# Altium schematic sheet sdcard_ram.SchDoc
size Letter
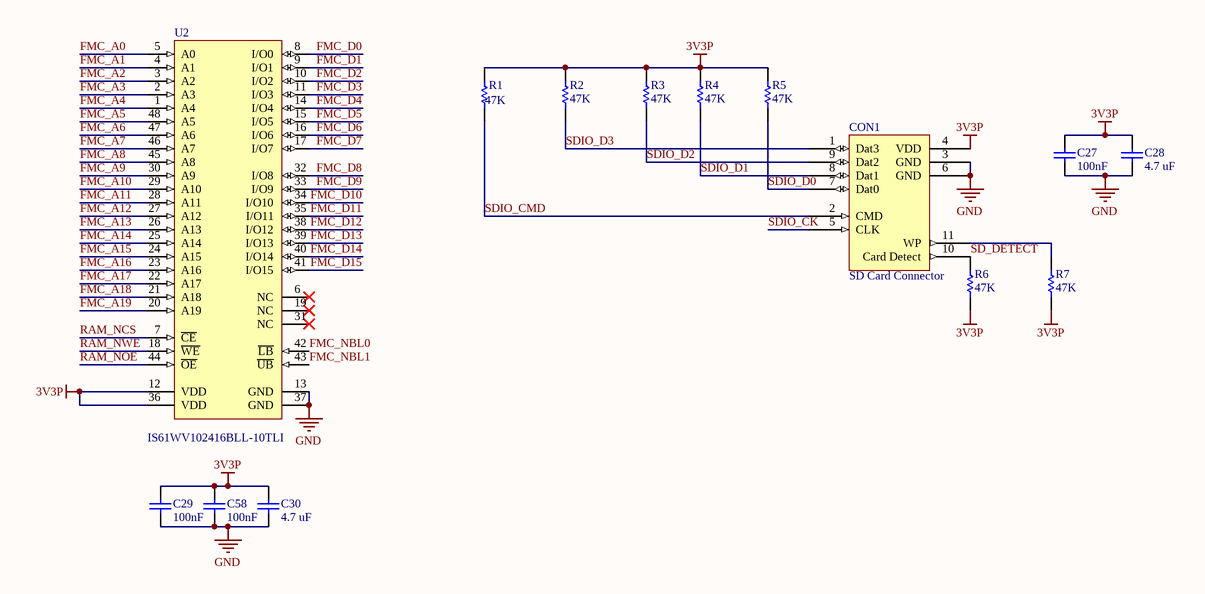
[diagram p0: sdcard_ram.SchDoc]

## Parts
C27  100nF  [C0805]
C28  4.7 uF  [C0805]
C29  100nF  [C0805]
C30  4.7 uF  [C0805]
C58  100nF  [C0805]
CON1  SD Card Connector  [SD_card_fp]
R1  47K  [6-0805_M]
R2  47K  [6-0805_M]
R3  47K  [6-0805_M]
R4  47K  [6-0805_M]
R5  47K  [6-0805_M]
R6  47K  [6-0805_M]
R7  47K  [6-0805_M]
U2  IS61WV102416BLL-10TLI  [ISSI-TSOP-1-48-12000X20000DE_N]

## Nets
3V3P: C27.2 C28.2 C29.2 C30.2 C58.2 CON1.4(VDD) R1.2 R2.2 R3.2 R4.2 R5.2 R6.1 R7.1 U2.12(VDD) U2.36(VDD)
GND: C27.1 C28.1 C29.1 C30.1 C58.1 CON1.3(GND) CON1.6(GND) U2.13(GND) U2.37(GND)
FMC_A0: U2.5(A0)
FMC_A1: U2.4(A1)
FMC_A2: U2.3(A2)
FMC_A3: U2.2(A3)
FMC_A4: U2.1(A4)
FMC_A5: U2.48(A5)
FMC_A6: U2.47(A6)
FMC_A7: U2.46(A7)
FMC_A8: U2.45(A8)
FMC_A9: U2.30(A9)
FMC_A10: U2.29(A10)
FMC_A11: U2.28(A11)
FMC_A12: U2.27(A12)
FMC_A13: U2.26(A13)
FMC_A14: U2.25(A14)
FMC_A15: U2.24(A15)
FMC_A16: U2.23(A16)
FMC_A17: U2.22(A17)
FMC_A18: U2.21(A18)
FMC_A19: U2.20(A19)
FMC_D0: U2.8(I/O0)
FMC_D1: U2.9(I/O1)
FMC_D2: U2.10(I/O2)
FMC_D3: U2.11(I/O3)
FMC_D4: U2.14(I/O4)
FMC_D5: U2.15(I/O5)
FMC_D6: U2.16(I/O6)
FMC_D7: U2.17(I/O7)
FMC_D8: U2.32(I/O8)
FMC_D9: U2.33(I/O9)
FMC_D10: U2.34(I/O10)
FMC_D11: U2.35(I/O11)
FMC_D12: U2.38(I/O12)
FMC_D13: U2.39(I/O13)
FMC_D14: U2.40(I/O14)
FMC_D15: U2.41(I/O15)
FMC_NBL0: U2.42(~{LB})
FMC_NBL1: U2.43(~{UB})
RAM_NCS: U2.7(~{CE})
RAM_NOE: U2.44(~{OE})
RAM_NWE: U2.18(~{WE})
SD_DETECT: CON1.10(Card_Detect) R6.2
SDIO_CK: CON1.5(CLK)
SDIO_CMD: CON1.2(CMD) R1.1
SDIO_D0: CON1.7(Dat0) R5.1
SDIO_D1: CON1.8(Dat1) R4.1
SDIO_D2: CON1.9(Dat2) R3.1
SDIO_D3: CON1.1(Dat3) R2.1
NetCON1_11: CON1.11(WP) R7.2

Not connected (* = marked no-connect by the designer): U2 6(NC)* 19(NC)* 31(NC)*

## Library data of the parts
C27-C30 C58 = Cap: Capacitor; Published: 8-Jun-2000; LatestRevisionDate: 17-Jul-2002; LatestRevisionNote: Re-released for DXP Platform.; PackageReference: RAD-0.3; Publisher: Altium Limited; PackageDescription: Radial Cap, Thru-Hole; 2 Leads; 0.3 in Pin Spacing
  C27 C29 C58: Value: 100nF
  C28 C30: Value: 4.7 uF
CON1 = SD Card Connector: 3M™ Card Connector SD™
R1-R7 = Res1: Resistor; Published: 8-Jun-2000; LatestRevisionDate: 17-Jul-2002; LatestRevisionNote: Re-released for DXP Platform.; PackageReference: AXIAL-0.3; Publisher: Altium Limited; PackageDescription: Axial Device, Thru-Hole; 2 Leads; 0.3 in Pin Spacing; Value: 47K
U2 = IS61WV102416BLL-10TLI: 16 M High Speed Asynchronous CMOS SRAM with 3.3 V Supply, 1 M x 16, -40 to 85 degC, 48-Pin SOP (TSOP-1-48), Pb-Free; Manufacturer: Integrated Silicon Solution Inc (ISSI); Density: 16M; Organization: 1M x 16; Packing: Tray / Tube; Speed (ns): 10; DatasheetVersion: Rev. F; PackageVersion: Rev. B, 07/2006; PackageReference: TSOP-1-48; PackageDescription: 48-Pin 12 x 20 mm TSOP-1, Pitch 0.5 mm; Supplier 1: Digi-Key; Supplier Part Number 1: 706-1055-ND; Supplier 2: Farnell; Supplier Part Number 2: 2253839; Supplier 3: Newark; Supplier Part Number 3: 53W9303; Supplier 4: Newark; Supplier Part Number 4: 43M5379; Supplier 5: Mouser; Supplier Part Number 5: 870-61WV102416B10TLI; RoHS: Pb-Free; Mounting Technology: Surface Mount; PartNumber: IS61WV102416BLL-10TLI; ComponentLink1Description: Manufacturer URL; ComponentLink1URL: http://www.issi.com/US/index.shtml; ComponentLink2Description: Datasheet; ComponentLink2URL: http://www.issi.com/WW/pdf/61WV102416ALL.pdf; ComponentLink3Description: Package Specification; ComponentLink3URL: http://www.issi.com/WW/pdf/61WV102416ALL.pdf